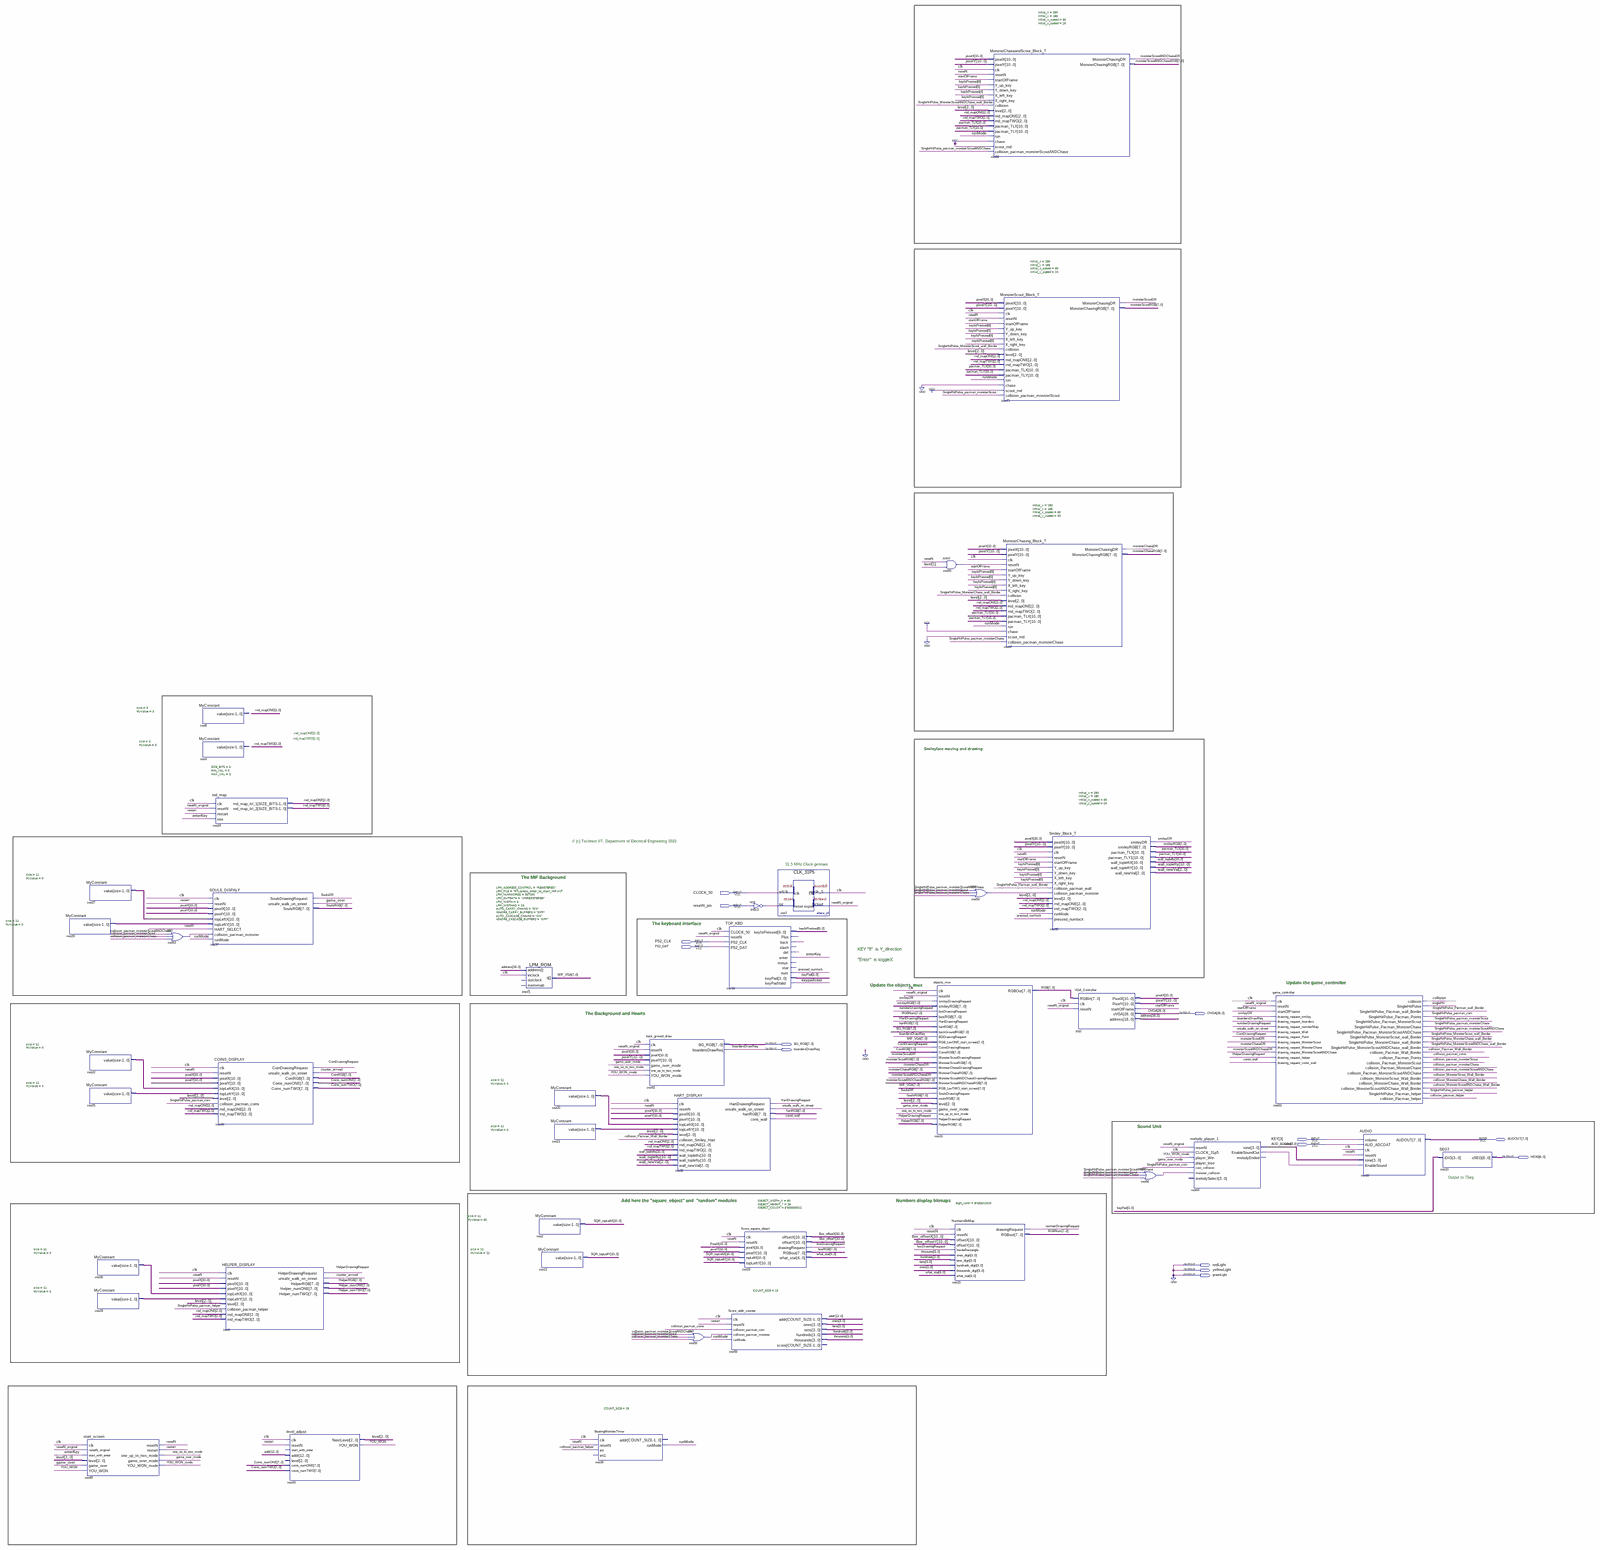
[diagram p0: schematic sheet, whole]
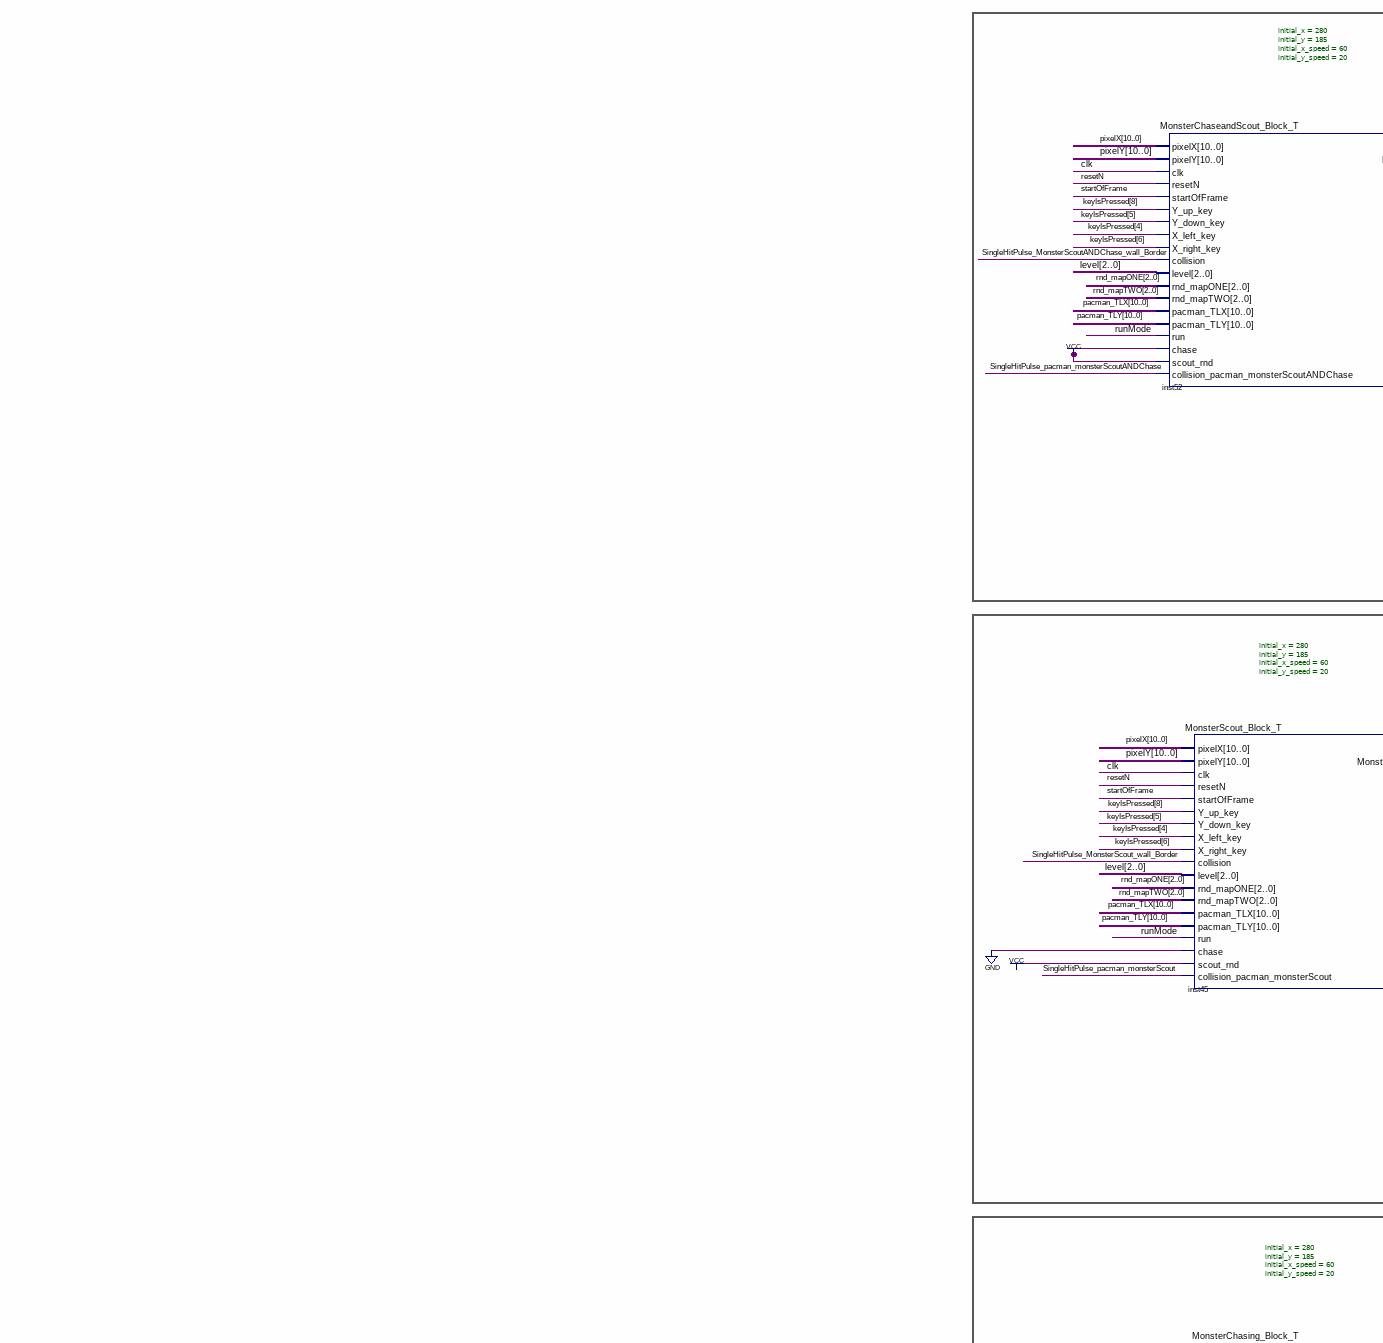
[diagram p1: schematic sheet, upper centre part]
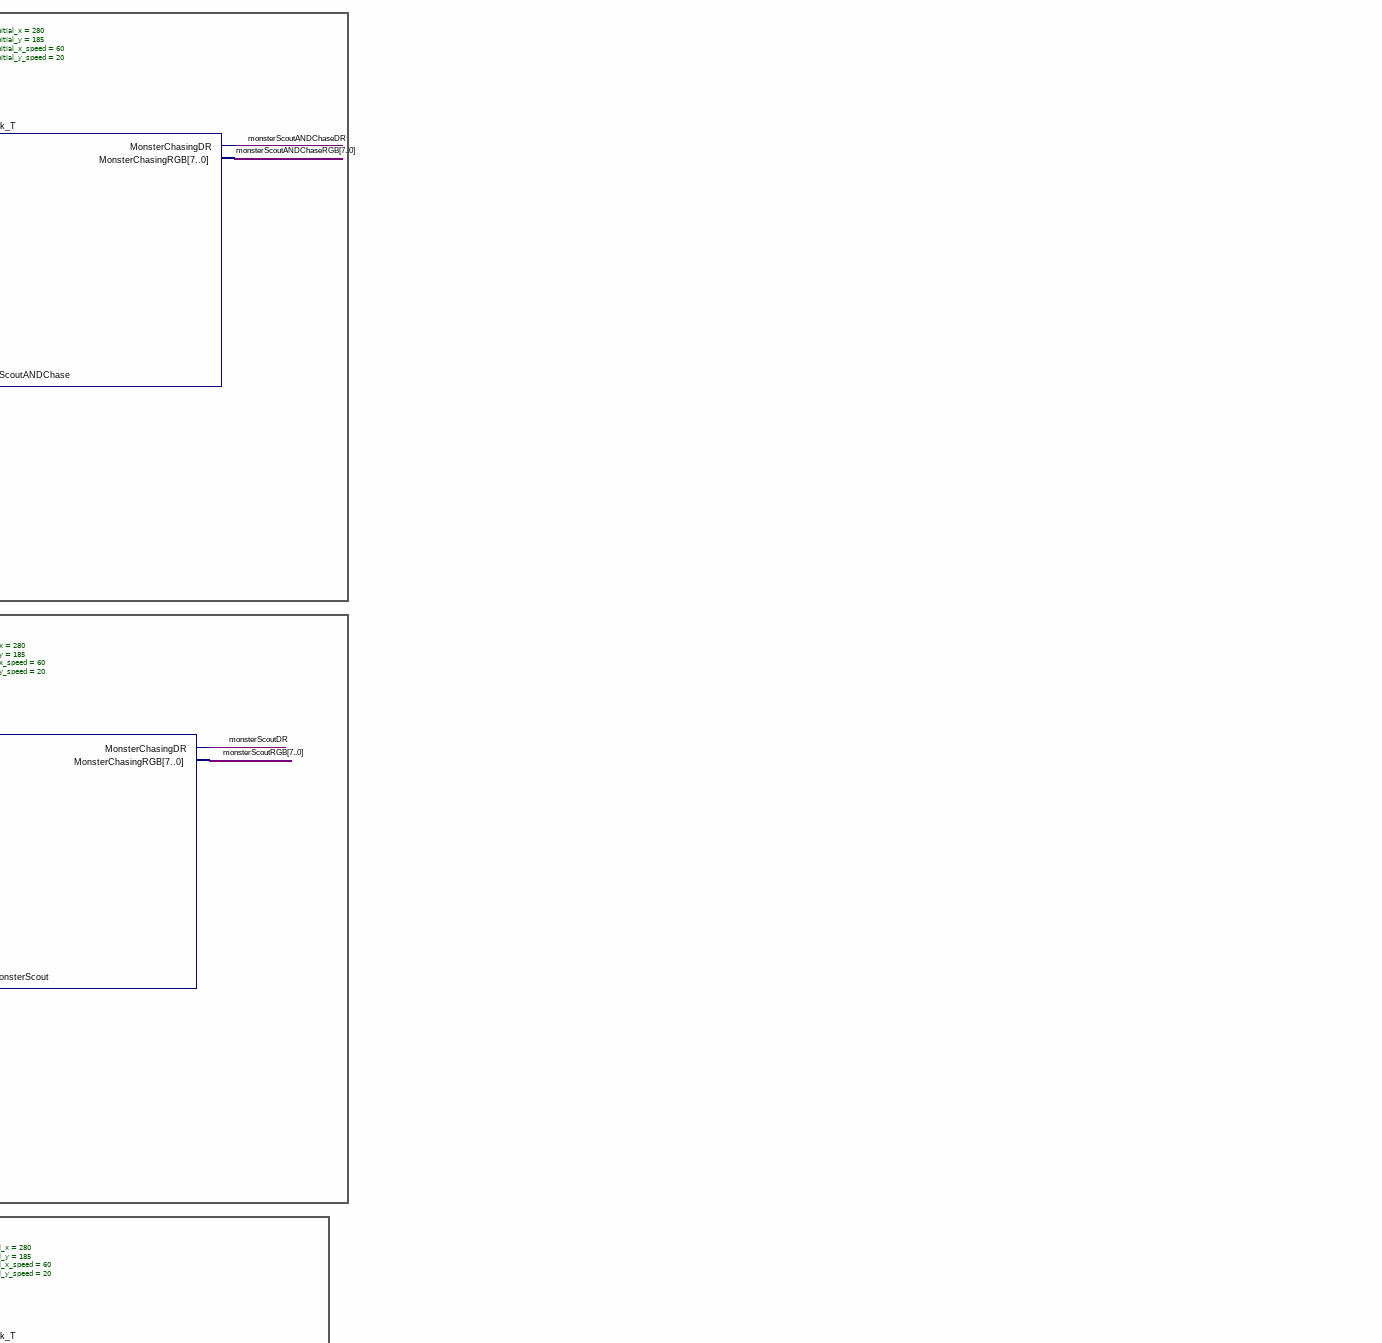
[diagram p2: schematic sheet, upper right part]
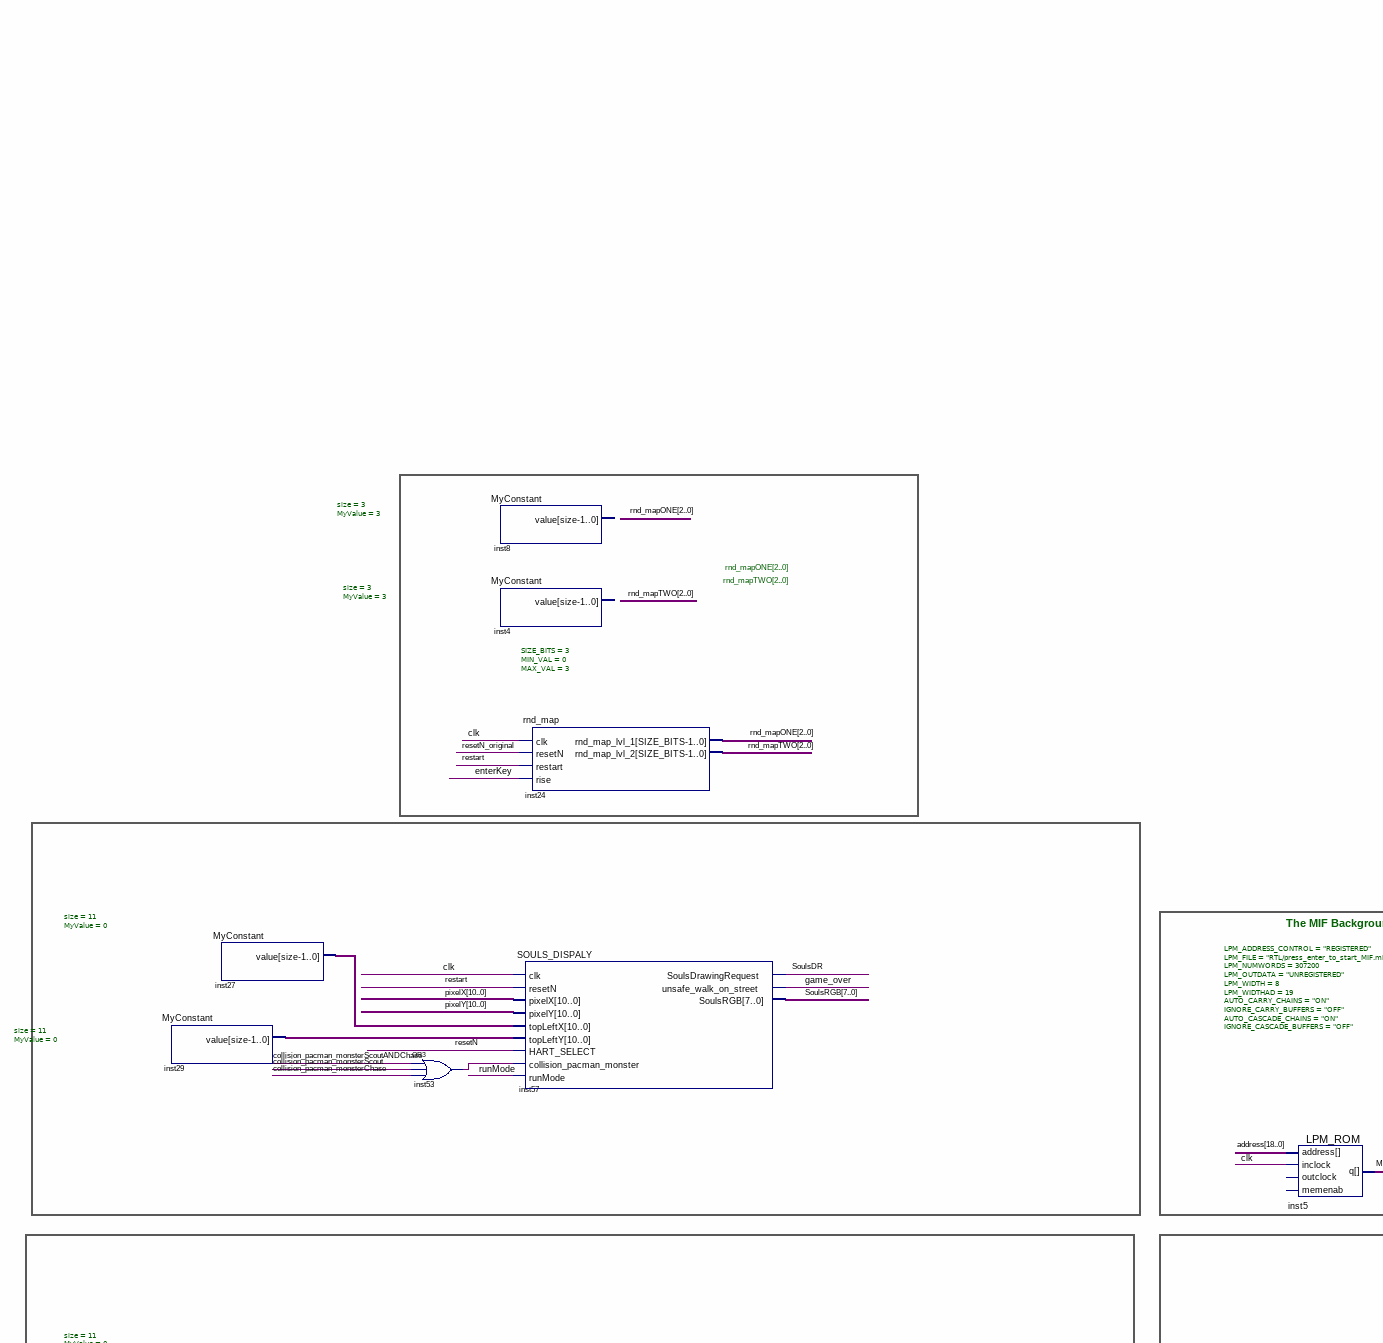
[diagram p3: schematic sheet, middle left part]
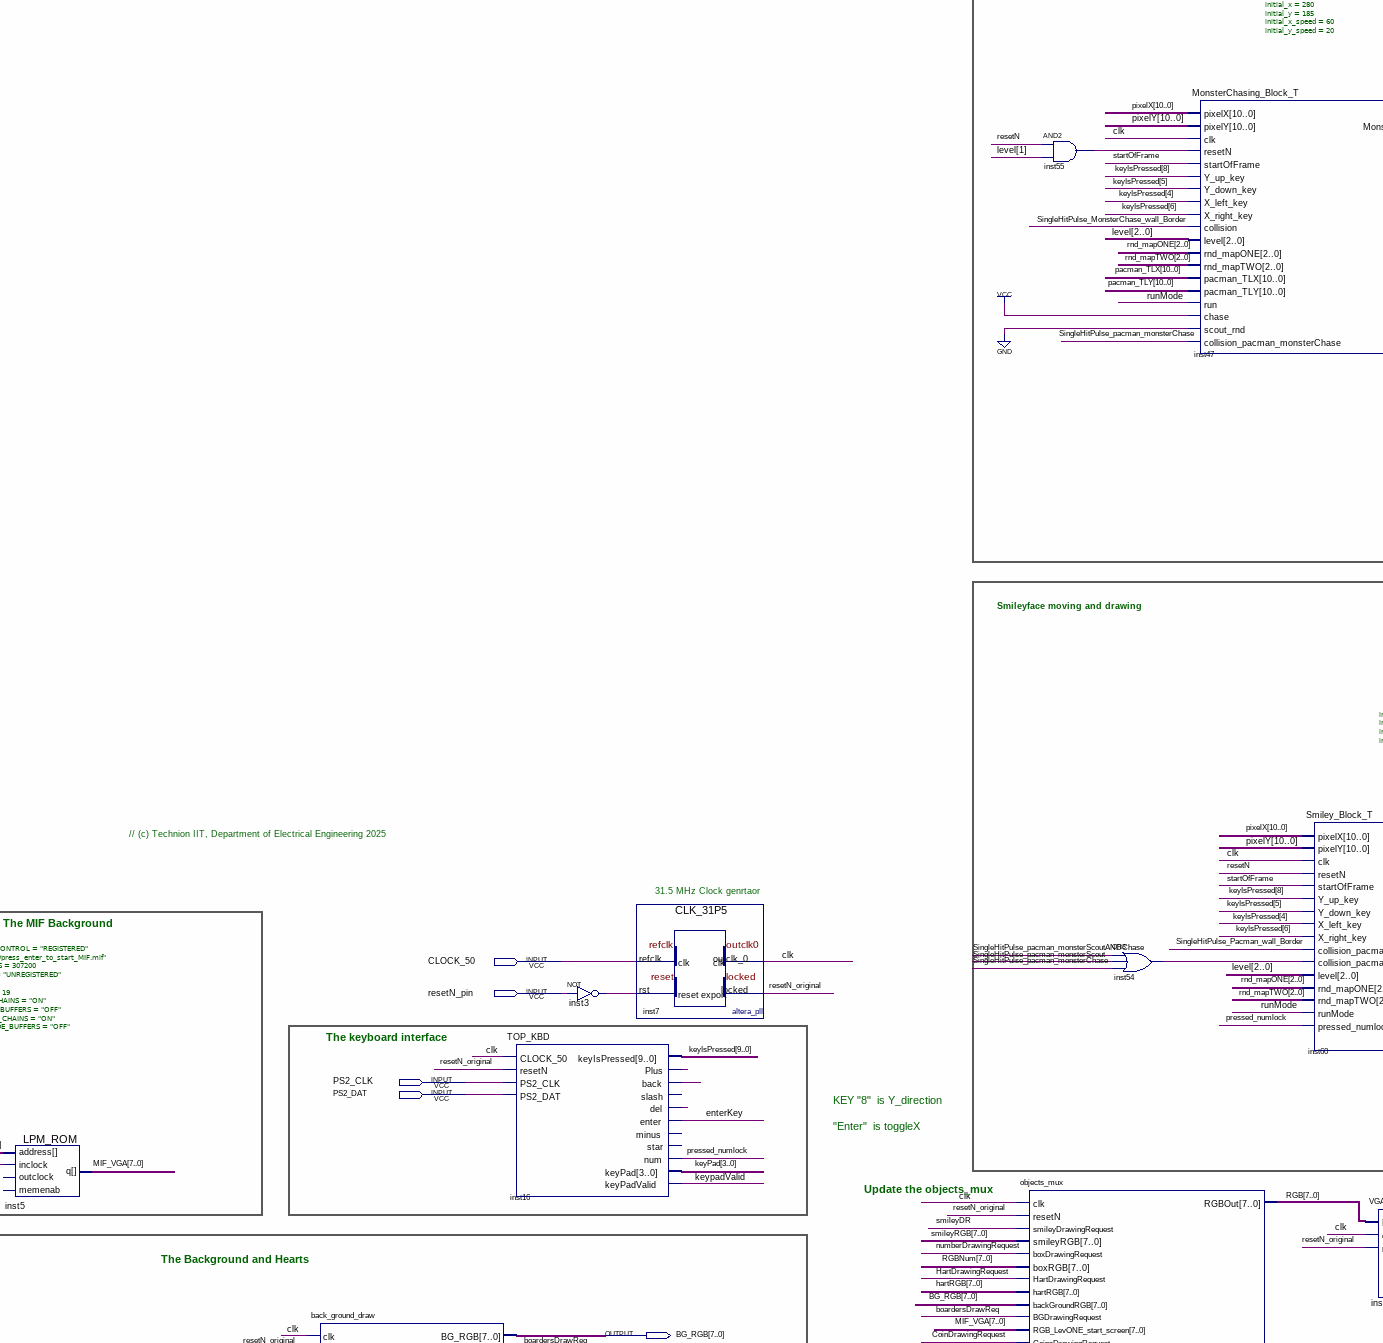
[diagram p4: schematic sheet, middle centre part]
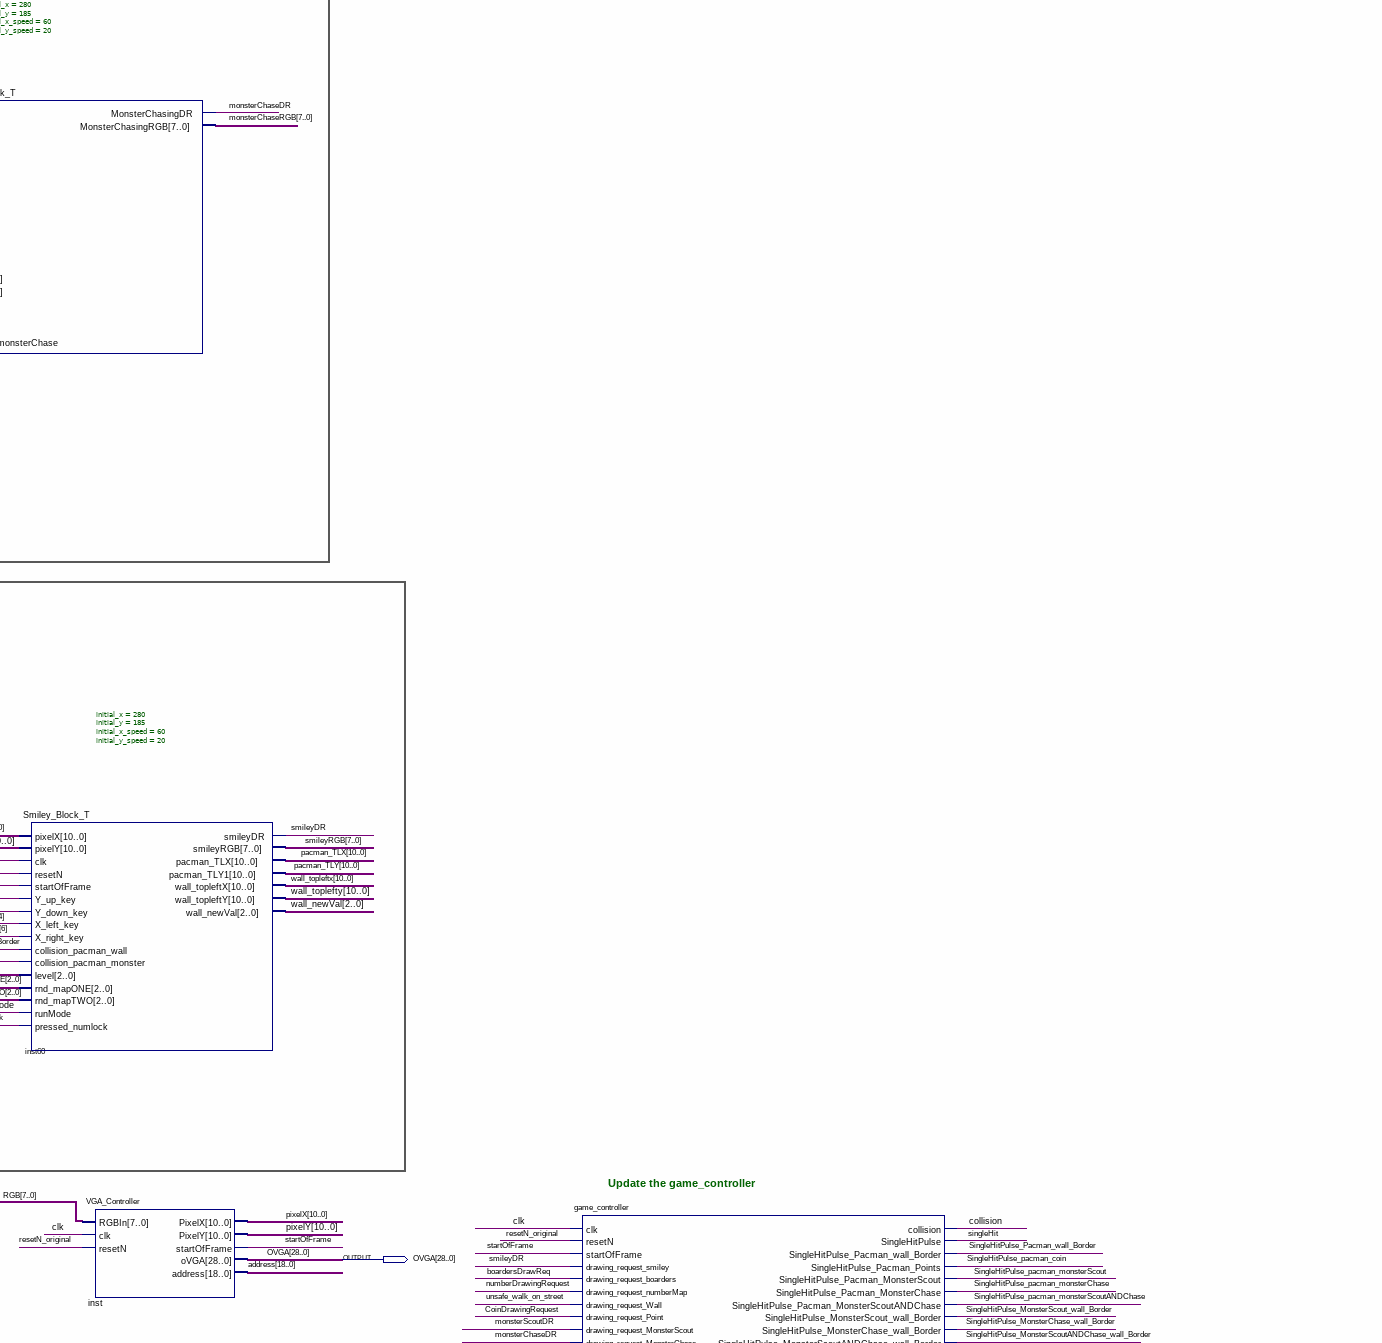
[diagram p5: schematic sheet, middle right part]
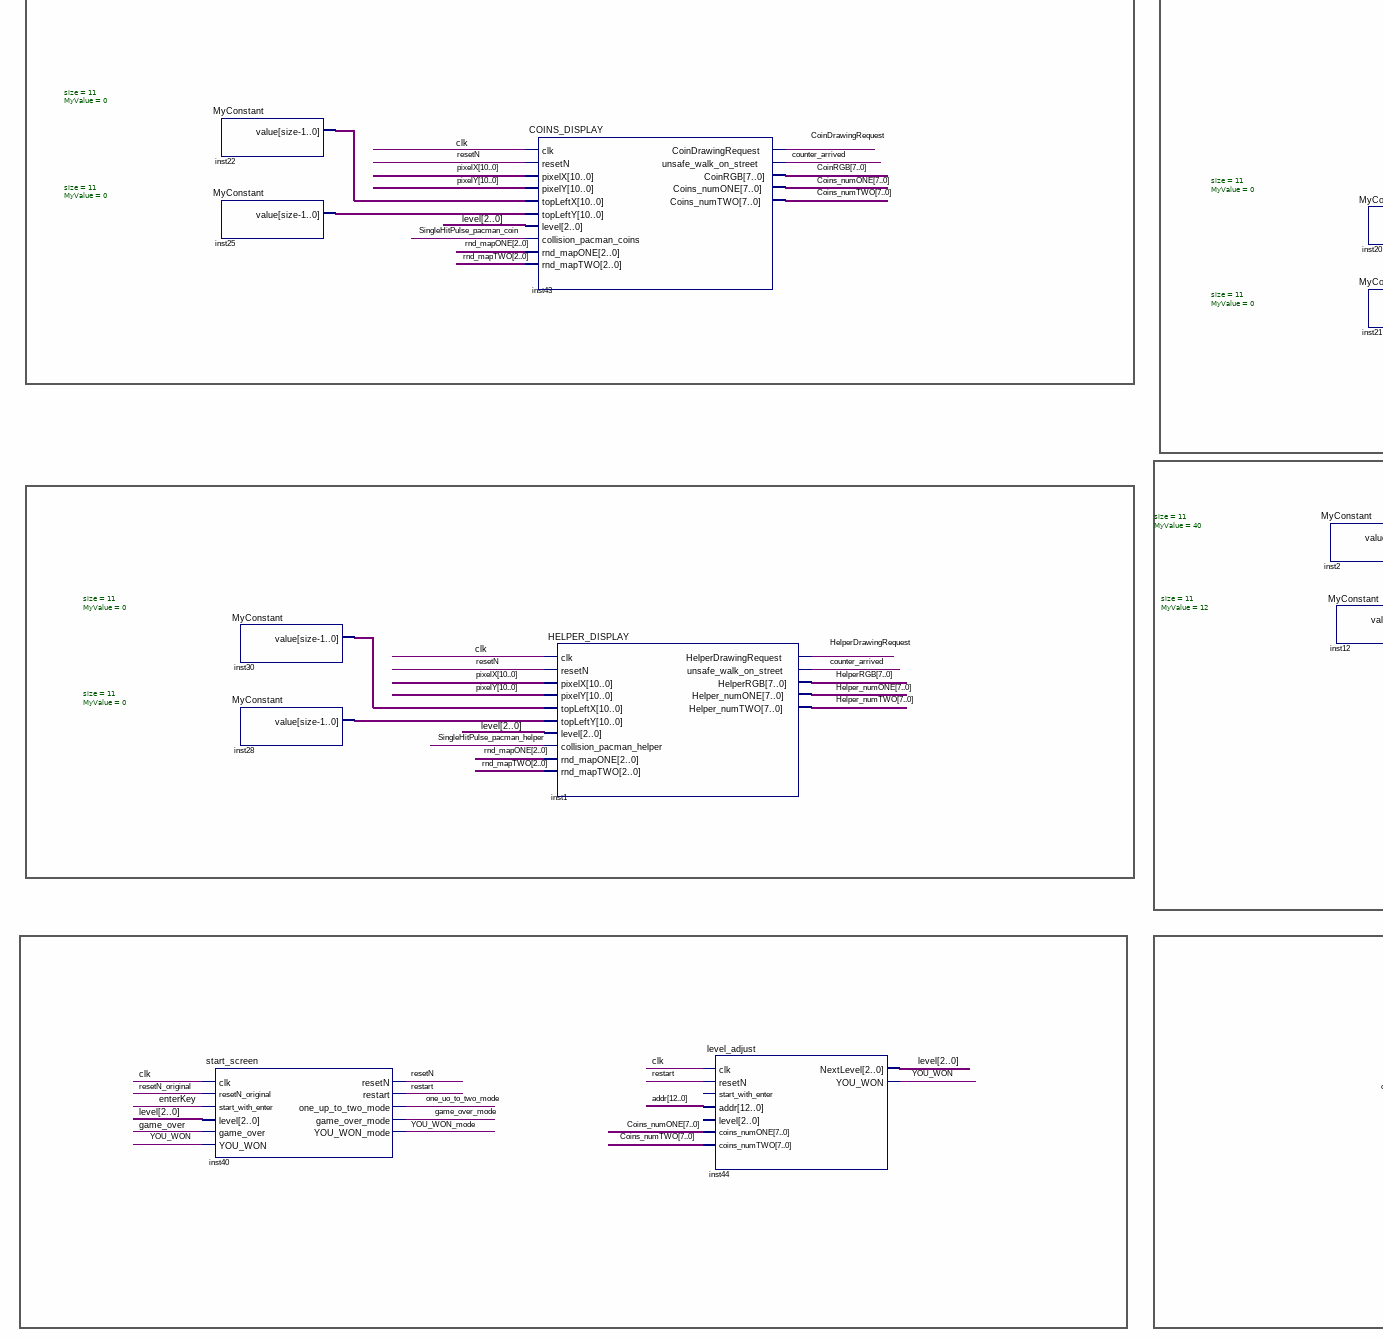
[diagram p6: schematic sheet, lower left part]
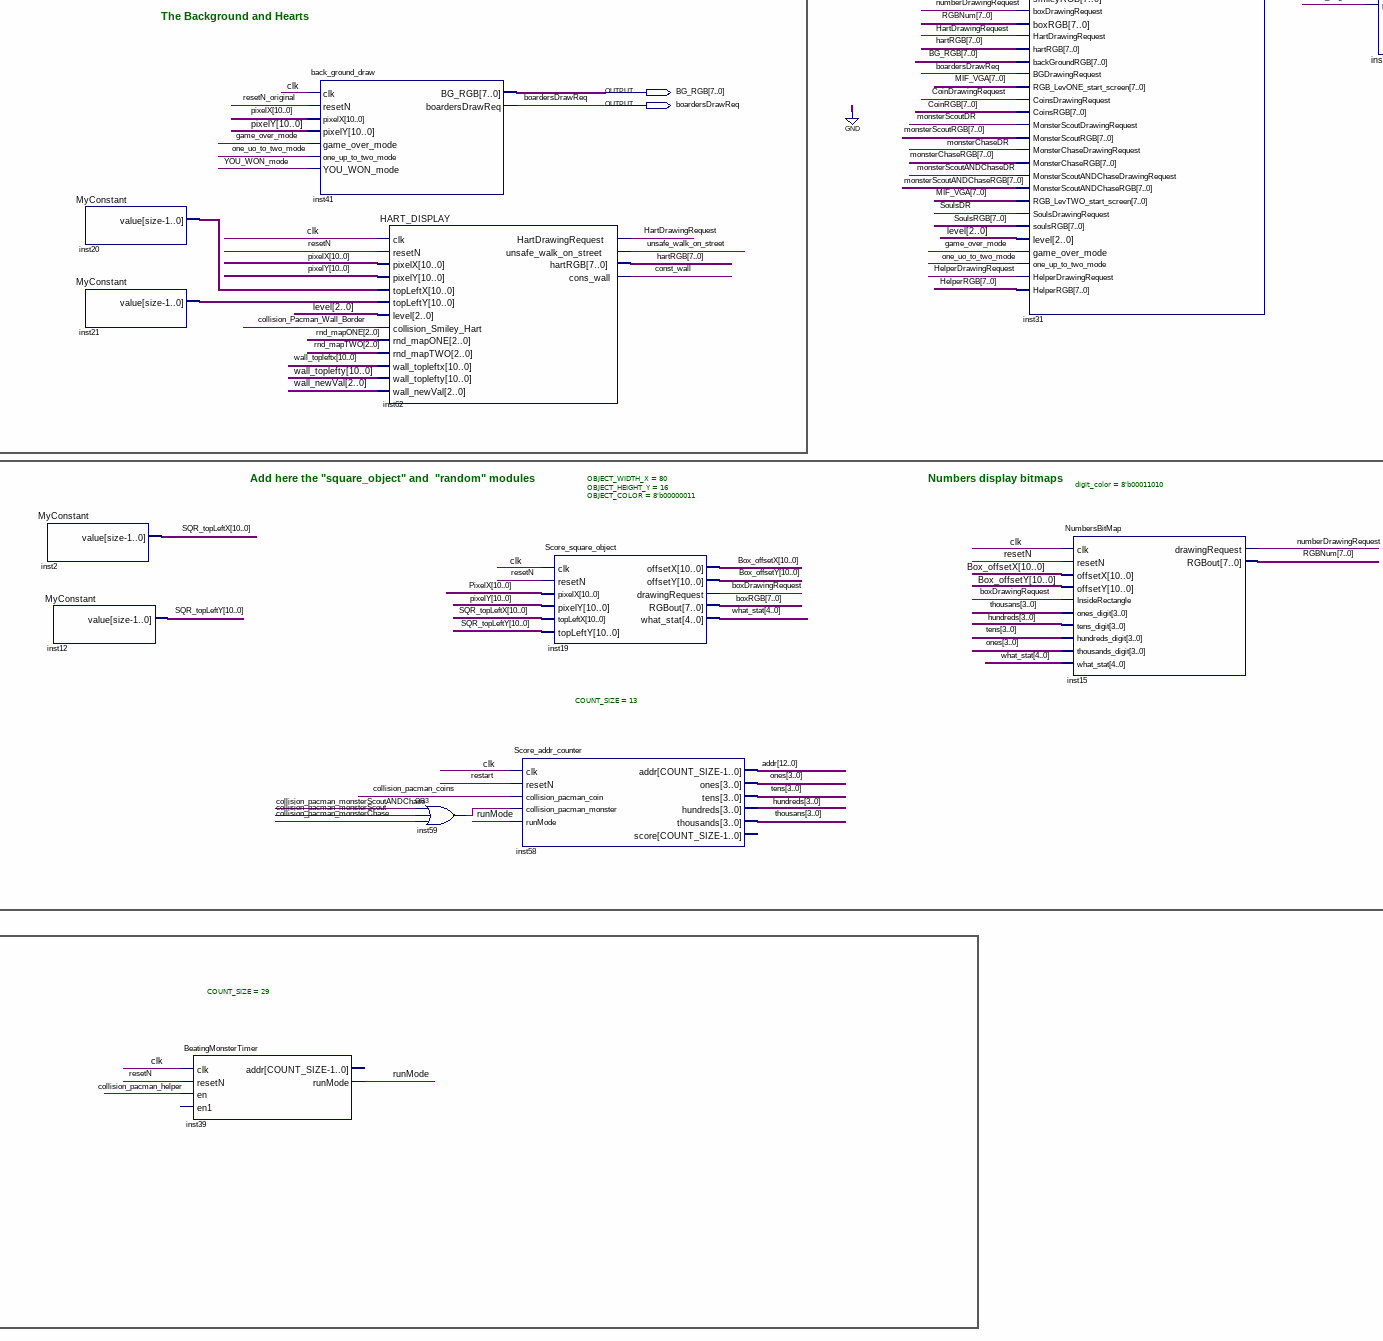
[diagram p7: schematic sheet, lower centre part]
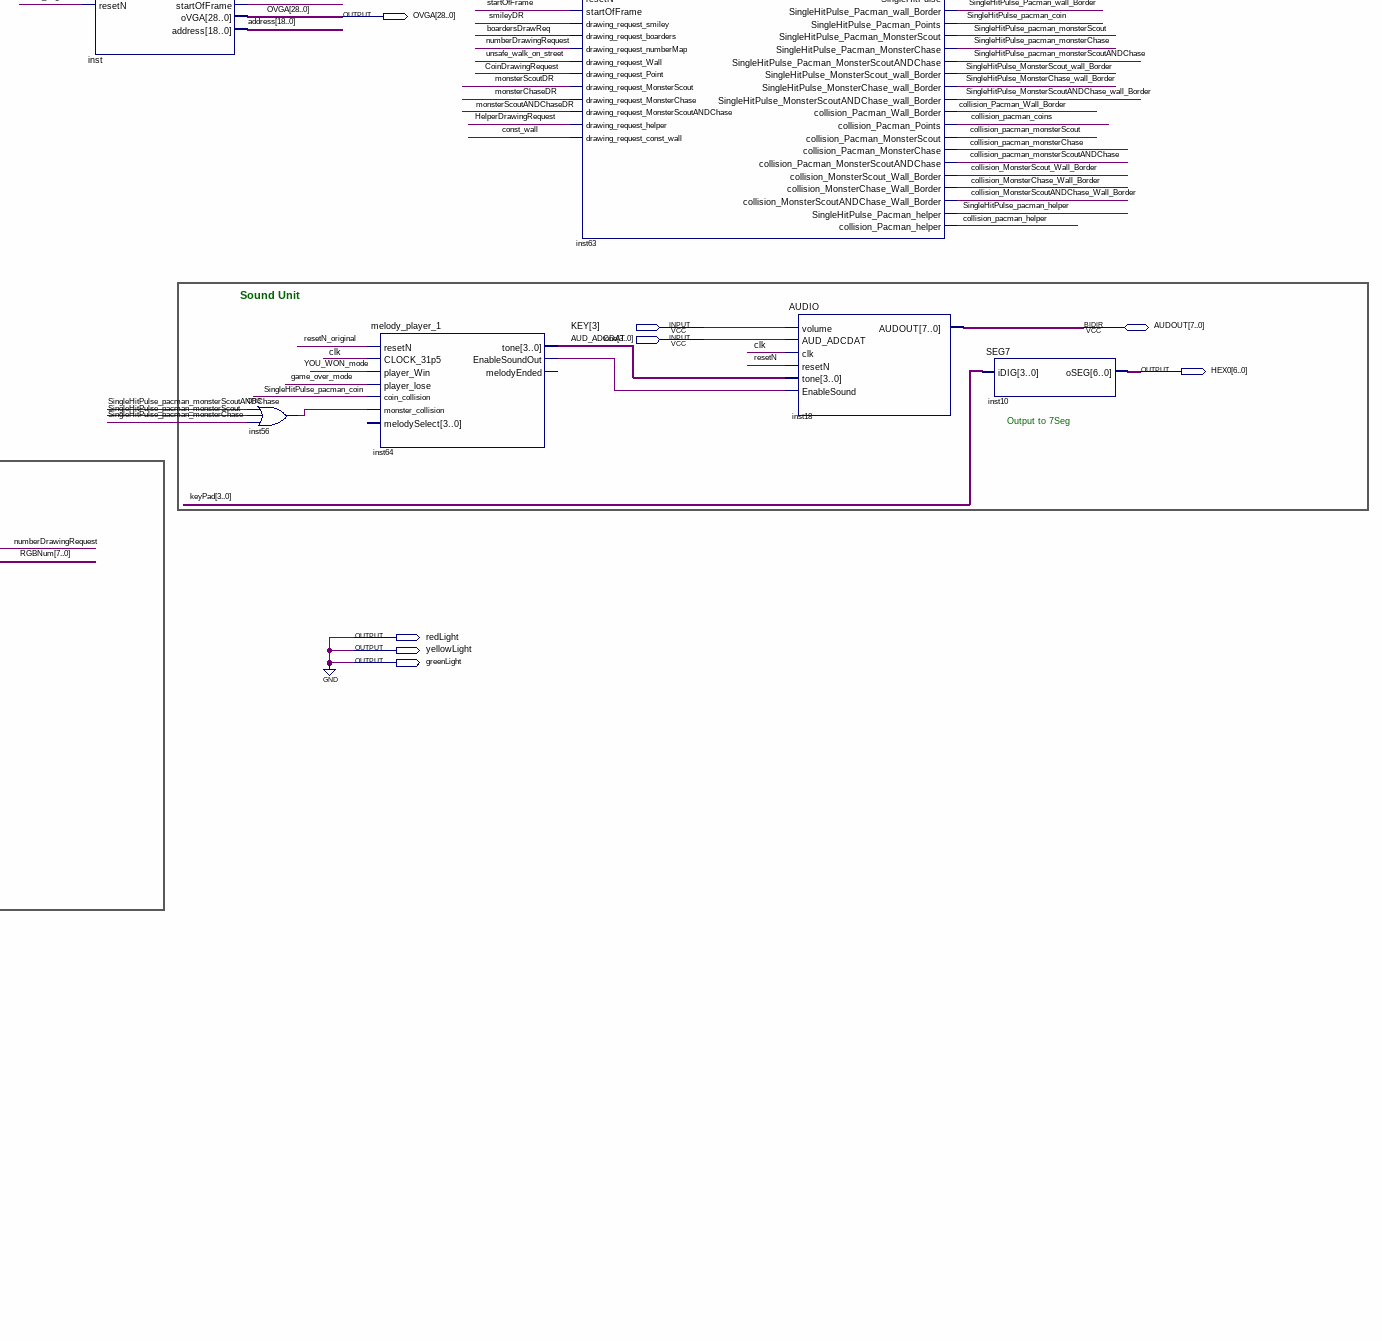
[diagram p8: schematic sheet, lower right part]
// Quartus schematic TOP_VGA_DEMO_KBD.bdf as structural Verilog: 43 symbols, 14 pins
module TOP_VGA_DEMO_KBD (
  input  CLOCK_50,
  input  resetN_pin,
  input  PS2_CLK,
  input  PS2_DAT,
  input  [3:3] KEY,
  input  AUD_ADCDAT,
  inout  [7:0] AUDOUT,
  output [28:0] OVGA,
  output [7:0] BG_RGB,
  output boardersDrawReq,
  output [6:0] HEX0,
  output redLight,
  output yellowLight,
  output greenLight
);

  wire boxDrawingRequest, clk, CoinDrawingRequest, collision, collision_MonsterChase_Wall_Border,
       collision_MonsterScout_Wall_Border, collision_MonsterScoutANDChase_Wall_Border,
       collision_pacman_coins, collision_pacman_helper, collision_pacman_monsterChase,
       collision_pacman_monsterScout, collision_pacman_monsterScoutANDChase, collision_Pacman_Wall_Border,
       const_wall, counter_arrived, enterKey, game_over, game_over_mode, HartDrawingRequest,
       HelperDrawingRequest, inst3_out, inst16_back, inst16_del, inst16_plus, inst53_out, inst54_out,
       inst55_out, inst56_out, inst59_out, inst64_enablesoundout, keypadValid, monsterChaseDR,
       monsterScoutANDChaseDR, monsterScoutDR, numberDrawingRequest, one_uo_to_two_mode, pressed_numlock,
       resetN, resetN_original, restart, runMode, singleHit, SingleHitPulse_MonsterChase_wall_Border,
       SingleHitPulse_MonsterScout_wall_Border, SingleHitPulse_MonsterScoutANDChase_wall_Border,
       SingleHitPulse_pacman_coin, SingleHitPulse_pacman_helper, SingleHitPulse_pacman_monsterChase,
       SingleHitPulse_pacman_monsterScout, SingleHitPulse_pacman_monsterScoutANDChase,
       SingleHitPulse_Pacman_wall_Border, smileyDR, SoulsDR, startOfFrame, unsafe_walk_on_street, YOU_WON,
       YOU_WON_mode;
  wire [2:0] level, rnd_mapONE, rnd_mapTWO, wall_newVal;
  wire [3:0] hundreds, keyPad, ones, tens, thousans, tone;
  wire [4:0] what_stat;
  wire [7:0] boxRGB, CoinRGB, Coins_numONE, Coins_numTWO, hartRGB, Helper_numONE, Helper_numTWO, HelperRGB,
       MIF_VGA, monsterChaseRGB, monsterScoutANDChaseRGB, monsterScoutRGB, RGB, RGBNum, smileyRGB, SoulsRGB;
  wire [9:0] keyIsPressed;
  wire [10:0] Box_offsetX, Box_offsetY, inst20_value, inst21_value, inst22_value, inst25_value, inst27_value,
       inst28_value, inst29_value, inst30_value, pacman_TLX, pacman_TLY, pixelX, pixelY, SQR_topLeftX,
       SQR_topLeftY, wall_topleftx, wall_toplefty;
  wire [12:0] addr;
  wire [18:0] address;

  MyConstant #(.size(11), .MyValue(0)) inst29 (.value(inst29_value));
  MyConstant #(.size(11), .MyValue(0)) inst27 (.value(inst27_value));
  MyConstant #(.size(11), .MyValue(0)) inst22 (.value(inst22_value));
  MyConstant #(.size(11), .MyValue(0)) inst25 (.value(inst25_value));
  MyConstant #(.size(11), .MyValue(0)) inst30 (.value(inst30_value));
  MyConstant #(.size(11), .MyValue(0)) inst28 (.value(inst28_value));
  start_screen inst40 (
    .clk(clk), .resetN_original(resetN_original), .start_with_enter(enterKey), .level(level),
    .game_over(game_over), .YOU_WON(YOU_WON), .resetN(resetN), .restart(restart),
    .one_up_to_two_mode(one_uo_to_two_mode), .game_over_mode(game_over_mode), .YOU_WON_mode(YOU_WON_mode));
  or inst53 (inst53_out, collision_pacman_monsterScoutANDChase, collision_pacman_monsterScout, collision_pacman_monsterChase);
  MyConstant #(.size(3), .MyValue(3)) inst8 ();  // open: value
  MyConstant #(.size(3), .MyValue(3)) inst4 ();  // open: value
  rnd_map #(.SIZE_BITS(3), .MIN_VAL(0), .MAX_VAL(3)) inst24 (
    .clk(clk), .resetN(resetN_original), .restart(restart), .rise(enterKey), .rnd_map_lvl_1(rnd_mapONE),
    .rnd_map_lvl_2(rnd_mapTWO));
  SOULS_DISPALY inst57 (
    .clk(clk), .resetN(restart), .pixelX(pixelX), .pixelY(pixelY), .topLeftX(inst27_value),
    .topLeftY(inst29_value), .HART_SELECT(resetN), .collision_pacman_monster(inst53_out), .runMode(runMode),
    .SoulsDrawingRequest(SoulsDR), .unsafe_walk_on_street(game_over), .SoulsRGB(SoulsRGB));
  COINS_DISPLAY inst43 (
    .clk(clk), .resetN(resetN), .pixelX(pixelX), .pixelY(pixelY), .topLeftX(inst22_value),
    .topLeftY(inst25_value), .level(level), .collision_pacman_coins(SingleHitPulse_pacman_coin),
    .rnd_mapONE(rnd_mapONE), .rnd_mapTWO(rnd_mapTWO), .CoinDrawingRequest(CoinDrawingRequest),
    .unsafe_walk_on_street(counter_arrived), .CoinRGB(CoinRGB), .Coins_numONE(Coins_numONE),
    .Coins_numTWO(Coins_numTWO));
  HELPER_DISPLAY inst1 (
    .clk(clk), .resetN(resetN), .pixelX(pixelX), .pixelY(pixelY), .topLeftX(inst30_value),
    .topLeftY(inst28_value), .level(level), .collision_pacman_helper(SingleHitPulse_pacman_helper),
    .rnd_mapONE(rnd_mapONE), .rnd_mapTWO(rnd_mapTWO), .HelperDrawingRequest(HelperDrawingRequest),
    .unsafe_walk_on_street(counter_arrived), .HelperRGB(HelperRGB), .Helper_numONE(Helper_numONE),
    .Helper_numTWO(Helper_numTWO));
  level_adjust inst44 (
    .clk(clk), .resetN(restart), .addr(addr), .coins_numONE(Coins_numONE), .coins_numTWO(Coins_numTWO),
    .NextLevel(level), .YOU_WON(YOU_WON));  // open: start_with_enter, level
  LPM_ROM #(.LPM_ADDRESS_CONTROL("REGISTERED"), .LPM_FILE("RTL/press_enter_to_start_MIF.mif"), .LPM_NUMWORDS(307200), .LPM_OUTDATA("UNREGISTERED"), .LPM_WIDTH(8), .LPM_WIDTHAD(19), .AUTO_CARRY_CHAINS("ON"), .IGNORE_CARRY_BUFFERS("OFF"), .AUTO_CASCADE_CHAINS("ON"), .IGNORE_CASCADE_BUFFERS("OFF")) inst5 (
    .address(address), .inclock(clk), .q(MIF_VGA));  // open: outclock, memenab
  MyConstant #(.size(11), .MyValue(0)) inst20 (.value(inst20_value));
  MyConstant #(.size(11), .MyValue(0)) inst21 (.value(inst21_value));
  MyConstant #(.size(11), .MyValue(40)) inst2 (.value(SQR_topLeftX));
  MyConstant #(.size(11), .MyValue(12)) inst12 (.value(SQR_topLeftY));
  BeatingMonsterTimer #(.COUNT_SIZE(29)) inst39 (
    .clk(clk), .resetN(resetN), .en(collision_pacman_helper), .runMode(runMode));  // open: en1, addr
  back_ground_draw inst41 (
    .clk(clk), .resetN(resetN_original), .pixelX(pixelX), .pixelY(pixelY), .game_over_mode(game_over_mode),
    .one_up_to_two_mode(one_uo_to_two_mode), .YOU_WON_mode(YOU_WON_mode), .BG_RGB(BG_RGB),
    .boardersDrawReq(boardersDrawReq));
  HART_DISPLAY inst62 (
    .clk(clk), .resetN(resetN), .pixelX(pixelX), .pixelY(pixelY), .topLeftX(inst20_value),
    .topLeftY(inst21_value), .level(level), .collision_Smiley_Hart(collision_Pacman_Wall_Border),
    .rnd_mapONE(rnd_mapONE), .rnd_mapTWO(rnd_mapTWO), .wall_topleftx(wall_topleftx),
    .wall_toplefty(wall_toplefty), .wall_newVal(wall_newVal), .HartDrawingRequest(HartDrawingRequest),
    .unsafe_walk_on_street(unsafe_walk_on_street), .hartRGB(hartRGB), .cons_wall(const_wall));
  or inst59 (inst59_out, collision_pacman_monsterScoutANDChase, collision_pacman_monsterScout, collision_pacman_monsterChase);
  TOP_KBD inst16 (
    .CLOCK_50(clk), .resetN(resetN_original), .PS2_CLK(PS2_CLK), .PS2_DAT(PS2_DAT),
    .keyIsPressed(keyIsPressed), .Plus(inst16_plus), .back(inst16_back), .del(inst16_del), .enter(enterKey),
    .num(pressed_numlock), .keyPad(keyPad), .keyPadValid(keypadValid));  // open: slash, minus, star
  Score_addr_counter #(.COUNT_SIZE(13)) inst58 (
    .clk(clk), .resetN(restart), .collision_pacman_coin(collision_pacman_coins),
    .collision_pacman_monster(inst59_out), .runMode(runMode), .addr(addr), .ones(ones), .tens(tens),
    .hundreds(hundreds), .thousands(thousans));  // open: score
  not inst3 (inst3_out, resetN_pin);
  Score_square_object #(.OBJECT_WIDTH_X(80), .OBJECT_HEIGHT_Y(16), .OBJECT_COLOR(8'b00000011)) inst19 (
    .clk(clk), .resetN(resetN), .pixelX(pixelX), .pixelY(pixelY), .topLeftX(SQR_topLeftX),
    .topLeftY(SQR_topLeftY), .offsetX(Box_offsetX), .offsetY(Box_offsetY),
    .drawingRequest(boxDrawingRequest), .RGBout(boxRGB), .what_stat(what_stat));
  CLK_31P5 inst7 (.refclk(CLOCK_50), .rst(inst3_out), .outclk_0(clk), .locked(resetN_original));
  objects_mux inst31 (
    .clk(clk), .resetN(resetN_original), .smileyDrawingRequest(smileyDR), .smileyRGB(smileyRGB),
    .boxDrawingRequest(numberDrawingRequest), .boxRGB(RGBNum), .HartDrawingRequest(HartDrawingRequest),
    .hartRGB(hartRGB), .backGroundRGB(BG_RGB), .BGDrawingRequest(boardersDrawReq),
    .RGB_LevONE_start_screen(MIF_VGA), .CoinsDrawingRequest(CoinDrawingRequest), .CoinsRGB(CoinRGB),
    .MonsterScoutDrawingRequest(monsterScoutDR), .MonsterScoutRGB(monsterScoutRGB),
    .MonsterChaseDrawingRequest(monsterChaseDR), .MonsterChaseRGB(monsterChaseRGB),
    .MonsterScoutANDChaseDrawingRequest(monsterScoutANDChaseDR),
    .MonsterScoutANDChaseRGB(monsterScoutANDChaseRGB), .RGB_LevTWO_start_screen(MIF_VGA),
    .SoulsDrawingRequest(SoulsDR), .soulsRGB(SoulsRGB), .level(level), .game_over_mode(game_over_mode),
    .one_up_to_two_mode(one_uo_to_two_mode), .HelperDrawingRequest(HelperDrawingRequest),
    .HelperRGB(HelperRGB), .RGBOut(RGB));
  and inst55 (inst55_out, resetN, level[1]);
  NumbersBitMap #(.digit_color(8'b00011010)) inst15 (
    .clk(clk), .resetN(resetN), .offsetX(Box_offsetX), .offsetY(Box_offsetY),
    .InsideRectangle(boxDrawingRequest), .ones_digit(thousans), .tens_digit(hundreds), .hundreds_digit(tens),
    .thousands_digit(ones), .what_stat(what_stat), .drawingRequest(numberDrawingRequest), .RGBout(RGBNum));
  or inst54 (inst54_out, SingleHitPulse_pacman_monsterScoutANDChase, SingleHitPulse_pacman_monsterScout, SingleHitPulse_pacman_monsterChase);
  MonsterChaseandScout_Block_T #(.initial_x(280), .initial_y(185), .initial_x_speed(60), .initial_y_speed(20)) inst52 (
    .pixelX(pixelX), .pixelY(pixelY), .clk(clk), .resetN(resetN), .startOfFrame(startOfFrame),
    .Y_up_key(keyIsPressed[8]), .Y_down_key(keyIsPressed[5]), .X_left_key(keyIsPressed[4]),
    .X_right_key(keyIsPressed[6]), .collision(SingleHitPulse_MonsterScoutANDChase_wall_Border),
    .level(level), .rnd_mapONE(rnd_mapONE), .rnd_mapTWO(rnd_mapTWO), .pacman_TLX(pacman_TLX),
    .pacman_TLY(pacman_TLY), .run(runMode), .chase(1'b1), .scout_rnd(1'b1),
    .collision_pacman_monsterScoutANDChase(SingleHitPulse_pacman_monsterScoutANDChase),
    .MonsterChasingDR(monsterScoutANDChaseDR), .MonsterChasingRGB(monsterScoutANDChaseRGB));
  MonsterScout_Block_T #(.initial_x(280), .initial_y(185), .initial_x_speed(60), .initial_y_speed(20)) inst45 (
    .pixelX(pixelX), .pixelY(pixelY), .clk(clk), .resetN(resetN), .startOfFrame(startOfFrame),
    .Y_up_key(keyIsPressed[8]), .Y_down_key(keyIsPressed[5]), .X_left_key(keyIsPressed[4]),
    .X_right_key(keyIsPressed[6]), .collision(SingleHitPulse_MonsterScout_wall_Border), .level(level),
    .rnd_mapONE(rnd_mapONE), .rnd_mapTWO(rnd_mapTWO), .pacman_TLX(pacman_TLX), .pacman_TLY(pacman_TLY),
    .run(runMode), .chase(1'b0), .scout_rnd(1'b1),
    .collision_pacman_monsterScout(SingleHitPulse_pacman_monsterScout), .MonsterChasingDR(monsterScoutDR),
    .MonsterChasingRGB(monsterScoutRGB));
  MonsterChasing_Block_T #(.initial_x(280), .initial_y(185), .initial_x_speed(60), .initial_y_speed(20)) inst47 (
    .pixelX(pixelX), .pixelY(pixelY), .clk(clk), .resetN(inst55_out), .startOfFrame(startOfFrame),
    .Y_up_key(keyIsPressed[8]), .Y_down_key(keyIsPressed[5]), .X_left_key(keyIsPressed[4]),
    .X_right_key(keyIsPressed[6]), .collision(SingleHitPulse_MonsterChase_wall_Border), .level(level),
    .rnd_mapONE(rnd_mapONE), .rnd_mapTWO(rnd_mapTWO), .pacman_TLX(pacman_TLX), .pacman_TLY(pacman_TLY),
    .run(runMode), .chase(1'b1), .scout_rnd(1'b0),
    .collision_pacman_monsterChase(SingleHitPulse_pacman_monsterChase), .MonsterChasingDR(monsterChaseDR),
    .MonsterChasingRGB(monsterChaseRGB));
  Smiley_Block_T #(.initial_x(280), .initial_y(185), .initial_x_speed(60), .initial_y_speed(20)) inst60 (
    .pixelX(pixelX), .pixelY(pixelY), .clk(clk), .resetN(resetN), .startOfFrame(startOfFrame),
    .Y_up_key(keyIsPressed[8]), .Y_down_key(keyIsPressed[5]), .X_left_key(keyIsPressed[4]),
    .X_right_key(keyIsPressed[6]), .collision_pacman_wall(SingleHitPulse_Pacman_wall_Border),
    .collision_pacman_monster(inst54_out), .level(level), .rnd_mapONE(rnd_mapONE), .rnd_mapTWO(rnd_mapTWO),
    .runMode(runMode), .pressed_numlock(pressed_numlock), .smileyDR(smileyDR), .smileyRGB(smileyRGB),
    .pacman_TLX(pacman_TLX), .pacman_TLY1(pacman_TLY), .wall_topleftX(wall_topleftx),
    .wall_topleftY(wall_toplefty), .wall_newVal(wall_newVal));
  VGA_Controller inst (
    .RGBIn(RGB), .clk(clk), .resetN(resetN_original), .PixelX(pixelX), .PixelY(pixelY),
    .startOfFrame(startOfFrame), .oVGA(OVGA), .address(address));
  or inst56 (inst56_out, SingleHitPulse_pacman_monsterScoutANDChase, SingleHitPulse_pacman_monsterScout, SingleHitPulse_pacman_monsterChase);
  melody_player_1 inst64 (
    .resetN(resetN_original), .CLOCK_31p5(clk), .player_Win(YOU_WON_mode), .player_lose(game_over_mode),
    .coin_collision(SingleHitPulse_pacman_coin), .monster_collision(inst56_out), .tone(tone),
    .EnableSoundOut(inst64_enablesoundout));  // open: melodySelect, melodyEnded
  game_controller inst63 (
    .clk(clk), .resetN(resetN_original), .startOfFrame(startOfFrame), .drawing_request_smiley(smileyDR),
    .drawing_request_boarders(boardersDrawReq), .drawing_request_numberMap(numberDrawingRequest),
    .drawing_request_Wall(unsafe_walk_on_street), .drawing_request_Point(CoinDrawingRequest),
    .drawing_request_MonsterScout(monsterScoutDR), .drawing_request_MonsterChase(monsterChaseDR),
    .drawing_request_MonsterScoutANDChase(monsterScoutANDChaseDR),
    .drawing_request_helper(HelperDrawingRequest), .drawing_request_const_wall(const_wall),
    .collision(collision), .SingleHitPulse(singleHit),
    .SingleHitPulse_Pacman_wall_Border(SingleHitPulse_Pacman_wall_Border),
    .SingleHitPulse_Pacman_Points(SingleHitPulse_pacman_coin),
    .SingleHitPulse_Pacman_MonsterScout(SingleHitPulse_pacman_monsterScout),
    .SingleHitPulse_Pacman_MonsterChase(SingleHitPulse_pacman_monsterChase),
    .SingleHitPulse_Pacman_MonsterScoutANDChase(SingleHitPulse_pacman_monsterScoutANDChase),
    .SingleHitPulse_MonsterScout_wall_Border(SingleHitPulse_MonsterScout_wall_Border),
    .SingleHitPulse_MonsterChase_wall_Border(SingleHitPulse_MonsterChase_wall_Border),
    .SingleHitPulse_MonsterScoutANDChase_wall_Border(SingleHitPulse_MonsterScoutANDChase_wall_Border),
    .collision_Pacman_Wall_Border(collision_Pacman_Wall_Border),
    .collision_Pacman_Points(collision_pacman_coins),
    .collision_Pacman_MonsterScout(collision_pacman_monsterScout),
    .collision_Pacman_MonsterChase(collision_pacman_monsterChase),
    .collision_Pacman_MonsterScoutANDChase(collision_pacman_monsterScoutANDChase),
    .collision_MonsterScout_Wall_Border(collision_MonsterScout_Wall_Border),
    .collision_MonsterChase_Wall_Border(collision_MonsterChase_Wall_Border),
    .collision_MonsterScoutANDChase_Wall_Border(collision_MonsterScoutANDChase_Wall_Border),
    .SingleHitPulse_Pacman_helper(SingleHitPulse_pacman_helper),
    .collision_Pacman_helper(collision_pacman_helper));
  AUDIO inst18 (
    .volume(KEY[3]), .AUD_ADCDAT(AUD_ADCDAT), .clk(clk), .resetN(resetN), .tone(tone),
    .EnableSound(inst64_enablesoundout), .AUDOUT(AUDOUT));
  SEG7 inst10 (.iDIG(keyPad), .oSEG(HEX0));

  assign greenLight = 1'b0;
  assign redLight = 1'b0;
  assign yellowLight = 1'b0;

  // Notes on the sheet:
  //   rnd_mapONE[2..0]
  //   rnd_mapTWO[2..0]
  //   Smileyface moving and drawing
  //   // (c) Technion IIT, Department of Electrical Engineering 2025
  //   31.5 MHz Clock genrtaor
  //   The MIF Background
  //   The keyboard interface
  //   KEY "8"  is Y_direction
  //   "Enter"  is toggleX
  //   Update the game_controller
  //   Update the objects_mux
  //   The Background and Hearts
  //   Sound Unit
  //   Output to 7Seg
  //   Add here the "square_object" and  "random" modules
  //   Numbers display bitmaps
endmodule
